# Altium project Mega.PrjPcb
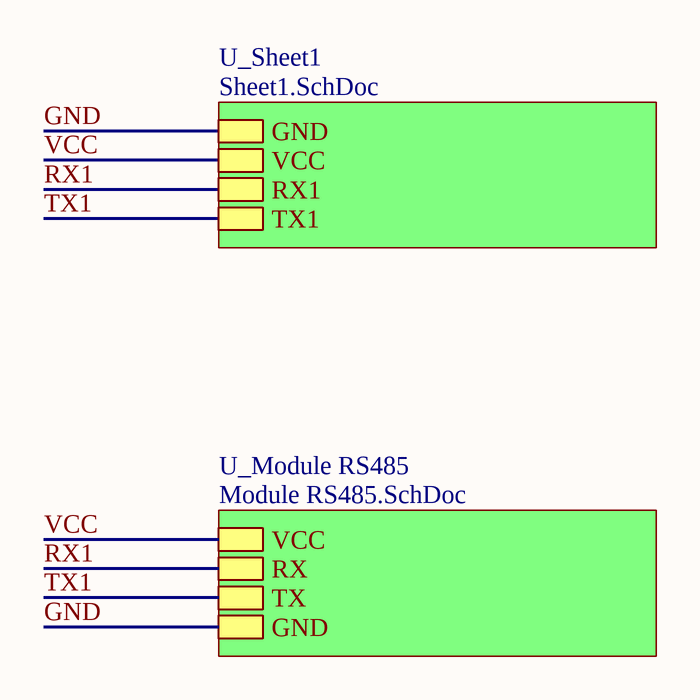
[diagram p0: TopLayer.SchDoc]
3 sheets, 33 parts. Net scope: hierarchical (ports join the sheet entries above them; power ports are global).
Board file: PCB2.PcbDoc
Sheets:
  TopLayer.SchDoc
    U_Module RS485 = Module RS485.SchDoc
    U_Sheet1 = Sheet1.SchDoc

## Sheet TopLayer.SchDoc
size A

### Sub-sheets
U_Module RS485 = Module RS485.SchDoc: VCC, RX, TX, GND
U_Sheet1 = Sheet1.SchDoc: GND, VCC, RX1, TX1

### Nets
GND: sheet U_Module RS485/GND, sheet U_Sheet1/GND
VCC: sheet U_Module RS485/VCC, sheet U_Sheet1/VCC
RX1: sheet U_Module RS485/RX, sheet U_Sheet1/RX1  [project net D19 (RX1)]
TX1: sheet U_Module RS485/TX, sheet U_Sheet1/TX1  [project net D18 (TX1)]

## Sheet Module RS485.SchDoc
size A
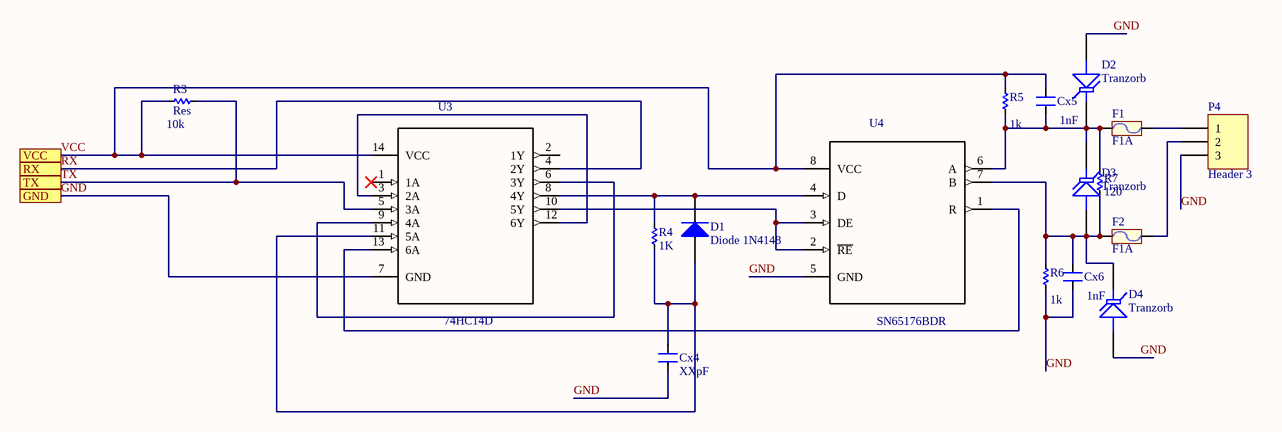
[diagram p1: Module RS485.SchDoc]

### Parts
Cx4  XXpF  [CN-SMD-1206]
Cx5  value 1nF  [CN-SMD-1206]
Cx6  value 1nF  [CN-SMD-1206]
D1  Diode 1N4148  [DO-35]
D2  Tranzorb  [DO-7]
D3  Tranzorb  [DO-7]
D4  Tranzorb  [DO-7]
F1  F1A  [Fuse3]
F2  F1A  [Fuse3]
P4  Header 3  [HDR1X3]
R3  Res  value 10k  [RES-SMD-1206]
R4  1K  [RES-SMD-1206]
R5  value 1k  [RES-SMD-1206]
R6  value 1k  [RES-SMD-1206]
R7  120  [RES-SMD-1206]
U3  74HC14D  [*SOIC127P600X175-14N]
U4  SN65176BDR  [*SOIC127P600X175-8N]

### Ports
GND, RX, TX, VCC

### Nets
GND: Cx4.1 Cx6.2 D2.1(A) D4.1(A) P4.3 R6.1 U3.7(GND) U4.5(GND) ; port GND
VCC: Cx5.1 R3.1 R5.2 U3.14(VCC) U4.8(VCC) ; port VCC
RX: U3.4(2Y) ; port RX  [project net D19 (RX1)]
TX: R3.2 U3.5(3A) ; port TX  [project net D18 (TX1)]
NetCx4_2: Cx4.2 D1.1(A) R4.2 U3.11(5A)
NetCx5_2: Cx5.2 D2.2(K) D3.2(K) F1.1 R5.1 R7.1 U4.6(A)
NetCx6_1: Cx6.1 D3.1(A) D4.2(K) F2.1 R6.2 R7.2 U4.7(B)
NetD1_2: D1.2(K) R4.1 U3.8(4Y) U4.4(D)
NetF1_2: F1.2 P4.1
NetF2_2: F2.2 P4.2
NetU3_3: U3.3(2A) U3.12(6Y)
NetU3_6: U3.6(3Y) U3.9(4A)
NetU3_10: U3.10(5Y) U4.2(~{RE}) U4.3(DE)
NetU3_13: U3.13(6A) U4.1(R)

Not connected (* = marked no-connect by the designer): U3 1(1A)* 2(1Y)

### Library data of the parts
Cx4 = CN: Value: 33pF
Cx5 Cx6 = CN
D1 = Diode 1N4148: High Conductance Fast Diode; Published: 8-Jun-2000; LatestRevisionDate: 17-Jul-2002; LatestRevisionNote: Re-released for DXP Platform.; DatasheetVersion: 1997; PackageReference: DO-35; Publisher: Altium Limited; PackageDescription: Diode, Axial; Body 3.8 x 1.9 mm (LxDia. max), Lead Dia. 0.53 mm (max); Code_JEDEC: DO-204-AH; ComponentLink1Description: Manufacturer Link; ComponentLink1URL: http://www.fairchildsemi.com/; ComponentLink2Description: Datasheet; ComponentLink2URL: http://www.fairchildsemi.com/ds/1N%2F1N4148.pdf
D2-D4 = Tranzorb: Transient Voltage Suppression (TVS) Diode; Published: 24-Mar-1999; LatestRevisionDate: 17-Jul-2002; LatestRevisionNote: Re-released for DXP Platform.; PackageReference: DO-7; Publisher: Altium Limited; PackageDescription: Axial Lead Diode
F1 F2 = Fuse: Designed by: VanDungEvn; Value: Fuse
P4 = Header 3: Header, 3-Pin; LatestRevisionDate: 17-Jul-2002; LatestRevisionNote: Re-released for DXP Platform.; Publisher: Altium Limited
R3-R7 = Res-SMD: Resistor; Manufacturer: Generic Components; Class: Passive; Published: 08/06/2000; Publisher: Altium Hobart Technology Centre
U3 = 74HC14D: 74HC CMOS logic IC series SOIC14 Hex Schmitt Inverter; MF: Toshiba Semiconductor; SnapEDA_Link: https://www.snapeda.com/parts/74HC14D/Toshiba%20Semiconductor%20and%20Storage/view-part/?ref=snap; Digi-Key_Part_Number: 74HC14DCT-ND; Digi-Key_Purchase_URL: https://www.digikey.vn/product-detail/en/toshiba-semiconductor-and-storage/74HC14D/74HC14DCT-ND/6109122?utm_source=snapeda&utm_medium=aggregator&utm_campaign=symbol; MP: 74HC14D; Package: SOIC-14 Toshiba; Value: *
U4 = SN65176BDR: Single Transmitter/Receiver RS-422/RS-485 8-Pin SOIC T/R; MF: Texas Instruments; MP: SN65176BDR; Digi-Key_Part_Number: 296-14636-1-ND; Package: SOIC-8 Texas Instruments; Digi-Key_Purchase_URL: https://www.digikey.vn/product-detail/en/texas-instruments/SN65176BDR/296-14636-1-ND/555935?utm_source=snapeda&utm_medium=aggregator&utm_campaign=symbol; SnapEDA_Link: https://www.snapeda.com/parts/SN65176BDR/Texas%20Instruments/view-part/?ref=snap; Value: *

## Sheet Sheet1.SchDoc
size A4
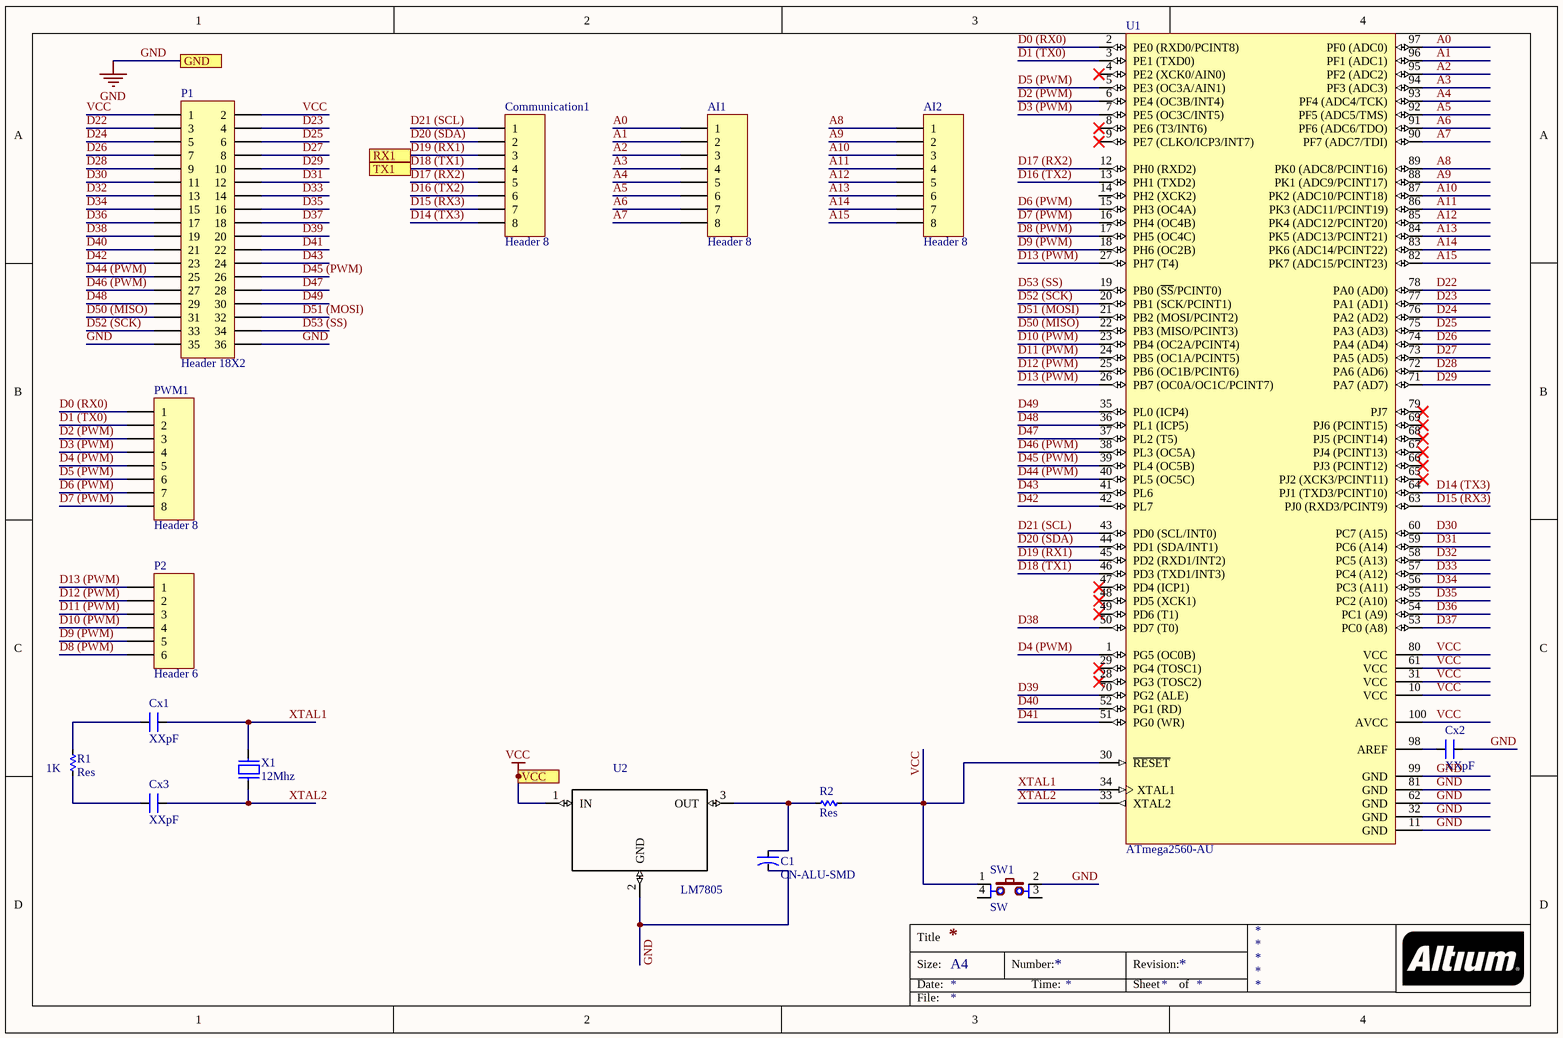
[diagram p2: Sheet1.SchDoc]

### Parts
AI1  Header 8  [HDR1X8]
AI2  Header 8  [HDR1X8]
C1  CN-ALU-SMD  [CAP-ALU-SMD-4.5x5x1.4]
Communication1  Header 8  [HDR1X8]
Cx1  XXpF  [CN-SMD-1206]
Cx2  XXpF  [CN-SMD-1206]
Cx3  XXpF  [CN-SMD-1206]
P1  Header 18X2  [HDR2X18]
P2  Header 6  [HDR1X6]
PWM1  Header 8  [HDR1X8]
R1  Res  value 1K  [RES-SMD-1206]
R2  Res  [RES-SMD-1206]
SW1  SW  [SW2-DIP]
U1  ATmega2560-AU  [TQFP100L]
U2  LM7805  [*TO220]
X1  12Mhz  [XT2]

### Ports
GND, RX1, TX1, VCC

### Nets
GND: C1.2 Cx2.2 P1.35 P1.36 SW1.2 U1.11(GND) U1.32(GND) U1.62(GND) U1.81(GND) U1.99(GND) U2.2(GND) ; port GND
VCC: P1.1 P1.2 R2.1 SW1.1 U1.10(VCC) U1.30(~{RESET}) U1.31(VCC) U1.61(VCC) U1.80(VCC) U1.100(AVCC) U2.1(IN) ; port VCC
A0: AI1.1 U1.97(PF0_(ADC0))
A1: AI1.2 U1.96(PF1_(ADC1))
A2: AI1.3 U1.95(PF2_(ADC2))
A3: AI1.4 U1.94(PF3_(ADC3))
A4: AI1.5 U1.93(PF4_(ADC4/TCK))
A5: AI1.6 U1.92(PF5_(ADC5/TMS))
A6: AI1.7 U1.91(PF6_(ADC6/TDO))
A7: AI1.8 U1.90(PF7_(ADC7/TDI))
A8: AI2.1 U1.89(PK0_(ADC8/PCINT16))
A9: AI2.2 U1.88(PK1_(ADC9/PCINT17))
A10: AI2.3 U1.87(PK2_(ADC10/PCINT18))
A11: AI2.4 U1.86(PK3_(ADC11/PCINT19))
A12: AI2.5 U1.85(PK4_(ADC12/PCINT20))
A13: AI2.6 U1.84(PK5_(ADC13/PCINT21))
A14: AI2.7 U1.83(PK6_(ADC14/PCINT22))
A15: AI2.8 U1.82(PK7_(ADC15/PCINT23))
D0 (RX0): PWM1.1 U1.2(PE0_(RXD0/PCINT8))
D1 (TX0): PWM1.2 U1.3(PE1_(TXD0))
D2 (PWM): PWM1.3 U1.6(PE4_(OC3B/INT4))
D3 (PWM): PWM1.4 U1.7(PE5_(OC3C/INT5))
D4 (PWM): PWM1.5 U1.1(PG5_(OC0B))
D5 (PWM): PWM1.6 U1.5(PE3_(OC3A/AIN1))
D6 (PWM): PWM1.7 U1.15(PH3_(OC4A))
D7 (PWM): PWM1.8 U1.16(PH4_(OC4B))
D8 (PWM): P2.6 U1.17(PH5_(OC4C))
D9 (PWM): P2.5 U1.18(PH6_(OC2B))
D10 (PWM): P2.4 U1.23(PB4_(OC2A/PCINT4))
D11 (PWM): P2.3 U1.24(PB5_(OC1A/PCINT5))
D12 (PWM): P2.2 U1.25(PB6_(OC1B/PCINT6))
D13 (PWM): P2.1 U1.26(PB7_(OC0A/OC1C/PCINT7)) U1.27(PH7_(T4))
D14 (TX3): Communication1.8 U1.64(PJ1_(TXD3/PCINT10))
D15 (RX3): Communication1.7 U1.63(PJ0_(RXD3/PCINT9))
D16 (TX2): Communication1.6 U1.13(PH1_(TXD2))
D17 (RX2): Communication1.5 U1.12(PH0_(RXD2))
D18 (TX1): Communication1.4 U1.46(PD3_(TXD1/INT3)) ; port TX1
D19 (RX1): Communication1.3 U1.45(PD2_(RXD1/INT2)) ; port RX1
D20 (SDA): Communication1.2 U1.44(PD1_(SDA/INT1))
D21 (SCL): Communication1.1 U1.43(PD0_(SCL/INT0))
D22: P1.3 U1.78(PA0_(AD0))
D23: P1.4 U1.77(PA1_(AD1))
D24: P1.5 U1.76(PA2_(AD2))
D25: P1.6 U1.75(PA3_(AD3))
D26: P1.7 U1.74(PA4_(AD4))
D27: P1.8 U1.73(PA5_(AD5))
D28: P1.9 U1.72(PA6_(AD6))
D29: P1.10 U1.71(PA7_(AD7))
D30: P1.11 U1.60(PC7_(A15))
D31: P1.12 U1.59(PC6_(A14))
D32: P1.13 U1.58(PC5_(A13))
D33: P1.14 U1.57(PC4_(A12))
D34: P1.15 U1.56(PC3_(A11))
D35: P1.16 U1.55(PC2_(A10))
D36: P1.17 U1.54(PC1_(A9))
D37: P1.18 U1.53(PC0_(A8))
D38: P1.19 U1.50(PD7_(T0))
D39: P1.20 U1.70(PG2_(ALE))
D40: P1.21 U1.52(PG1_(RD))
D41: P1.22 U1.51(PG0_(WR))
D42: P1.23 U1.42(PL7)
D43: P1.24 U1.41(PL6)
D44 (PWM): P1.25 U1.40(PL5_(OC5C))
D45 (PWM): P1.26 U1.39(PL4_(OC5B))
D46 (PWM): P1.27 U1.38(PL3_(OC5A))
D47: P1.28 U1.37(PL2_(T5))
D48: P1.29 U1.36(PL1_(ICP5))
D49: P1.30 U1.35(PL0_(ICP4))
D50 (MISO): P1.31 U1.22(PB3_(MISO/PCINT3))
D51 (MOSI): P1.32 U1.21(PB2_(MOSI/PCINT2))
D52 (SCK): P1.33 U1.20(PB1_(SCK/PCINT1))
D53 (SS): P1.34 U1.19(PB0_(~{SS}/PCINT0))
XTAL1: Cx1.2 U1.34(XTAL1) X1.2
XTAL2: Cx3.2 U1.33(XTAL2) X1.1
NetC1_1: C1.1 R2.2 U2.3(OUT)
NetCx1_1: Cx1.1 R1.1
NetCx2_1: Cx2.1 U1.98(AREF)
NetCx3_1: Cx3.1 R1.2

Not connected (* = marked no-connect by the designer): SW1 3 4; U1 4(PE2_(XCK0/AIN0))* 8(PE6_(T3/INT6))* 9(PE7_(CLKO/ICP3/INT7))* 14(PH2_(XCK2)) 28(PG3_(TOSC2))* 29(PG4_(TOSC1))* 47(PD4_(ICP1))* 48(PD5_(XCK1))* 49(PD6_(T1))* 65(PJ2_(XCK3/PCINT11))* 66(PJ3_(PCINT12))* 67(PJ4_(PCINT13))* 68(PJ5_(PCINT14))* 69(PJ6_(PCINT15))* 79(PJ7)*

### Notes on the sheet
- Title
- Size:
- Date:
- A4
- Number:
- Time:
- Revision:
- Sheet
- of
- File:

### Library data of the parts
AI1 AI2 Communication1 PWM1 = Header 8: Header, 8-Pin; LatestRevisionDate: 17-Jul-2002; LatestRevisionNote: Re-released for DXP Platform.; Publisher: Altium Limited
C1 = CN-ALU-SMD: Polarized Capacitor (Axial); Published: 8-Jun-2000; LatestRevisionDate: 17-Jul-2002; LatestRevisionNote: Re-released for DXP Platform.; PackageReference: POLAR0.8; Publisher: Altium Limited
Cx1 Cx3 = CN: Value: 22pF
Cx2 = CN: Value: 33pF
P1 = Header 18X2: Header, 18-Pin, Dual row; LatestRevisionDate: 17-Jul-2002; LatestRevisionNote: Re-released for DXP Platform.; Publisher: Altium Limited
P2 = Header 6: Header, 6-Pin; LatestRevisionDate: 17-Jul-2002; LatestRevisionNote: Re-released for DXP Platform.; Publisher: Altium Limited
R1 R2 = Res-SMD: as R3 on sheet Module RS485; Published: 08/06/2000; Publisher: Altium Hobart Technology Centre
SW1 = SW4: Switch button 4 pin; Value: Button chip 4 pin
U1 = ATmega2560-AU: 8-bit AVR Microcontroller, 4.5-5.5V, 256KB Flash, 4KB EEPROM, 8KB SRAM, 86 GPIO pins, 100-pin TQFP, Industrial Grade (-40°C to 85°C), Pb-Free; Supplier 1: Digi-Key; Supplier Part Number 1: ATMEGA2560-16AUR-ND
U2 = LM7805: MF: Texas Instruments; SnapEDA_Link: https://www.snapeda.com/parts/LM7805/Texas%20Instruments/view-part/?ref=snap; Availability: Unavailable; Price: None; MP: LM7805; Package: TO-220 Texas Instruments; Value: *
X1 = XT2: Crystal, 32.768 KHz, -40 to 85 degC, 3.2 x 1.5 x 0.9 mm SMD; Value: 4Mhz

## Nets that join several sheets
GND: Module RS485 (8 pins), Sheet1 (11 pins)
VCC: Module RS485 (5 pins), Sheet1 (11 pins)
D18 (TX1): Module RS485 (R3.2 U3.5), Sheet1 (Communication1.4 U1.46)
D19 (RX1): Module RS485 (U3.4), Sheet1 (Communication1.3 U1.45)